# Altium schematic sheet USB.SchDoc
size Letter; CompanyName: PloopyCo; Organization: Ploopy Co; Address1: 137-1140 Burnhamthorpe Road W; Address2: Mississauga; Address3: Ontario; Address4: Canada L5C 0A3; DocumentNumber: 7; Revision: R1.004; SheetNumber: 7; SheetTotal: 8
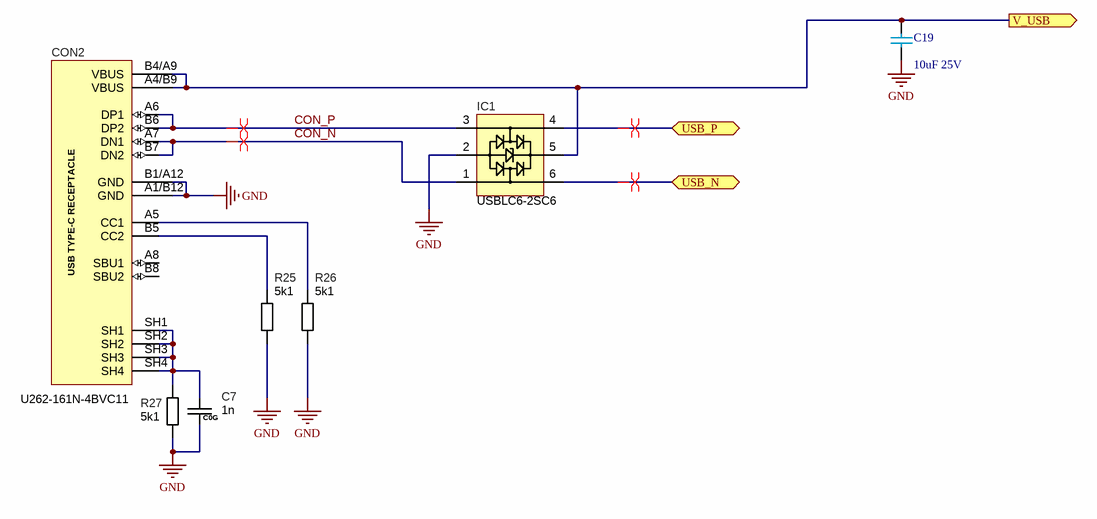
[diagram p0: USB.SchDoc]

## Parts
C7  1n  [C0603_C0G]
C19  value 10uF 25V  [C0603]  (hidden comment: 0805)
CON2  U262-161N-4BVC11  [USB_C]
IC1  USBLC6-2SC6  [sot23-6]
R25  5k1  [R0603]
R26  5k1  [R0603]
R27  5k1  [R0603]

## Ports
USB_N (bidir), USB_P (bidir), V_USB (out)

## Nets
GND: C7.2 C19.1 CON2.A1/B12(GND) CON2.B1/A12(GND) IC1.2(GND) R25.2 R26.2 R27.2
CON_N: CON2.A7(DN1) CON2.B7(DN2) IC1.1
CON_P: CON2.A6(DP1) CON2.B6(DP2) IC1.3
USB_N: IC1.6 ; port USB_N
USB_P: IC1.4 ; port USB_P
V_USB: C19.2 CON2.A4/B9(VBUS) CON2.B4/A9(VBUS) IC1.5(VBUS) ; port V_USB
NetC7_1: C7.1 CON2.SH1 CON2.SH2 CON2.SH3 CON2.SH4 R27.1
NetCON2_A5: CON2.A5(CC1) R26.1
NetCON2_B5: CON2.B5(CC2) R25.1

Not connected (* = marked no-connect by the designer): CON2 A8(SBU1) B8(SBU2)

## Layout directives
differential pair: CON_N, CON_P, USB_N, USB_P

## Notes on the sheet
- Copyright Ploopy Corporation 2019
- Licensed under the CERN OHL v. 1.2
- http://ohwr.org/cernohl
- Title:
- PCB:
- Version:
- Ploopy Corporation
- Mississauga ON L5C 0A3
- 137-1140 Burnhamthorpe Road W
- Date:
- Time:
- Sheet
- of
- Canada
- (in symbol C0603_C0G) C0G
- (in symbol USB_C_2.0) USB TYPE-C RECEPTACLE

## Library data of the parts
C7 = C0603_C0G: Precision 0603 C0G/NP0 capacitor footprint
C19 = Cap 10uF 25V: 0805, X5R or better; PNP-Nzl: 2; PNP-dx: 0; PNP-X: 2.00; PNP-Y: 1.25; PNP-Lv: 1; PNP-TS: 70; PNP-Type: chi; PNP-FeedType: Tape; PNP-TapeWidth: 8; PNP-dy: 0; PNP-Pt: 0; PNP-W: 0; PNP-Thk: 1.25; PNP-Level: 1; PNP-Voff: 0; PNP-PlacePriority: 1; PNP-A: 0; PNP-TapeIndex: 1; Supplier 1: Mouser; Supplier Part Number 1: 81-GRM21BR61E106KA3L; Supplier 2: Digi-Key; Supplier Part Number 2: 490-5523-1-ND; PNP-da: 0
CON2 = USB_C_2.0: USB C 2.0 connector, SMT, female
IC1 = USBLC6-2SC6: USB 2.0 ESD protection
R25-R27 = R0603: Generic 0603 resistor footprint